# Altium project PowerTest.PrjPcb
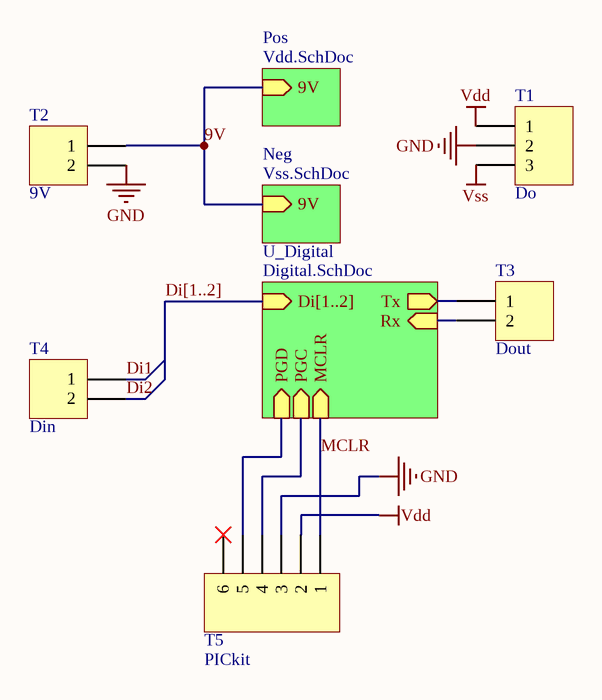
[diagram p0: Power.SchDoc]
4 sheets, 23 parts. Net scope: hierarchical (ports join the sheet entries above them; power ports are global).
Board file: PCB.PcbDoc
Sheets:
  Power.SchDoc
    U_Digital = Digital.SchDoc
    Pos = Vdd.SchDoc
    Neg = Vss.SchDoc

## Sheet Power.SchDoc
size A

### Parts
T1  Do  [HDR1X3]
T2  9V  [HDR1X2]
T3  Dout  [HDR1X2]
T4  Din  [HDR1X2]
T5  PICkit  [HDR1X6]

### Sub-sheets
Neg = Vss.SchDoc: 9V (in)
Pos = Vdd.SchDoc: 9V (in)
U_Digital = Digital.SchDoc: MCLR (in), Rx (in), Tx (out), PGD (in), PGC (in), Di[1..2] (in)

### Nets
GND: T1.2 T2.2 T5.3
Vdd: T1.1 T5.2
Vss: T1.3
9V: T2.1 ; sheet Pos/9V, sheet Neg/9V
Di1: T4.1
Di2: T4.2
MCLR: T5.1 ; sheet U_Digital/MCLR
NetT3_1: T3.1 ; sheet U_Digital/Tx
NetT3_2: T3.2 ; sheet U_Digital/Rx
NetT5_4: T5.4 ; sheet U_Digital/PGC
NetT5_5: T5.5 ; sheet U_Digital/PGD

Not connected (* = marked no-connect by the designer): T5 6*

### Buses and harness runs
bus Di[1..2] = sheet U_Digital/Di[1..2]

### Library data of the parts
T1 = Header 3: Header, 3-Pin; LatestRevisionDate: 17-Jul-2002; LatestRevisionNote: Re-released for DXP Platform.; Publisher: Altium Limited
T2-T4 = Header 2: Header, 2-Pin; LatestRevisionDate: 17-Jul-2002; LatestRevisionNote: Re-released for DXP Platform.; Publisher: Altium Limited
T5 = Header 6: Header, 6-Pin; LatestRevisionDate: 17-Jul-2002; LatestRevisionNote: Re-released for DXP Platform.; Publisher: Altium Limited

## Sheet Digital.SchDoc
size A
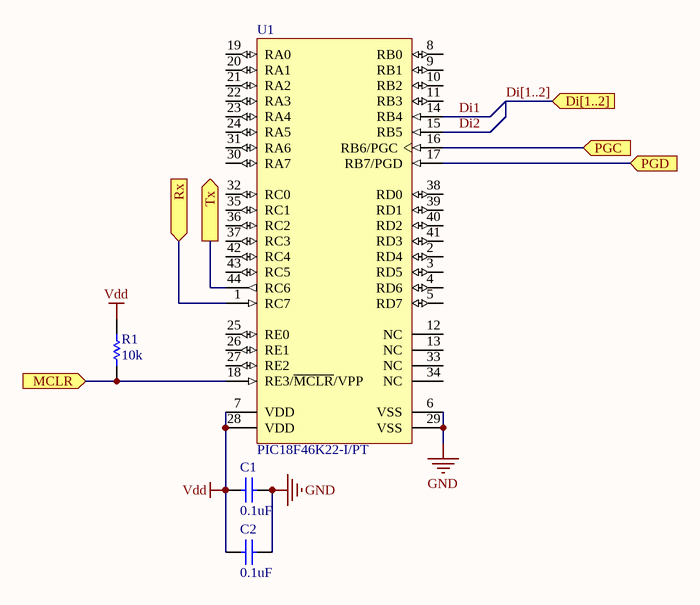
[diagram p1: Digital.SchDoc]

### Parts
C1  value 0.1uF  [1608[0603]]  (hidden comment: Cap)
C2  value 0.1uF  [1608[0603]]  (hidden comment: Cap)
R1  value 10k  [C1206]  (hidden comment: Res1)
U1  PIC18F46K22-I/PT  [MCHP-TQFP-PT44_N]

### Ports
Di[1..2] (in), MCLR (in), PGC (in), PGD (in), Rx (in), Tx (out)

### Nets
GND: C1.1 C2.1 U1.6(VSS) U1.29(VSS)
Vdd: C1.2 C2.2 R1.1 U1.7(VDD) U1.28(VDD)
Di1: U1.14(RB4)
Di2: U1.15(RB5)
MCLR: R1.2 U1.18(RE3/~{MCLR}/VPP) ; port MCLR
NetT3_1: U1.44(RC6) ; port Tx
NetT3_2: U1.1(RC7) ; port Rx
NetT5_4: U1.16(RB6/PGC) ; port PGC
NetT5_5: U1.17(RB7/PGD) ; port PGD

Not connected (* = marked no-connect by the designer): U1 2(RD4) 3(RD5) 4(RD6) 5(RD7) 8(RB0) 9(RB1) 10(RB2) 11(RB3) 12(NC) 13(NC) 19(RA0) 20(RA1) 21(RA2) 22(RA3) 23(RA4) 24(RA5) 25(RE0) 26(RE1) 27(RE2) 30(RA7) 31(RA6) 32(RC0) 33(NC) 34(NC) 35(RC1) 36(RC2) 37(RC3) 38(RD0) 39(RD1) 40(RD2) 41(RD3) 42(RC4) 43(RC5)

### Buses and harness runs
bus Di[1..2] = port Di[1..2]

### Library data of the parts
C1 C2 = Cap: Capacitor; Published: 8-Jun-2000; LatestRevisionDate: 17-Jul-2002; LatestRevisionNote: Re-released for DXP Platform.; PackageReference: RAD-0.3; Publisher: Altium Limited; PackageDescription: Radial Cap, Thru-Hole; 2 Leads; 0.3 in Pin Spacing
R1 = Res1: Resistor; Published: 8-Jun-2000; LatestRevisionDate: 17-Jul-2002; LatestRevisionNote: Re-released for DXP Platform.; PackageReference: AXIAL-0.3; Publisher: Altium Limited; PackageDescription: Axial Device, Thru-Hole; 2 Leads; 0.3 in Pin Spacing
U1 = PIC18F46K22-I/PT: Low-Power, High-Performance Microcontroller with XLP Technology, 64 MHz, 35 I/O, -40 to 85 degC, 44-pin TQFP (PT44), Tray; Manufacturer: Microchip; # of A/D Channels: 28; Digital Communication: 2 -A/E/USART, 2 -MSSP(SPI/I2C); EEPROM Data Memory (bytes): 1024; I/O Pins: 35; Internal Oscillator: 16 MHz, 31 kHz; Max. CPU Speed MHz: 64; Memory Type: Flash; Operation Voltage Range: 2.3V - 5.5V; Program Memory KWords: 32; RAM: 3896; Timers: 3 - 8-bit, 4 - 16-bit; DatasheetVersion: Rev. F; PackageVersion: C04-076B, 12/2012; PackageReference: TQFP-PT44; PackageDescription: 44-Lead Plastic Thin Quad Flatpack, 10 x 10 mm Body, 0.8 mm Pitch; Supplier 1: Digi-Key; Supplier Part Number 1: PIC18F46K22-I/PT-ND; Supplier 2: Farnell; Supplier Part Number 2: 1814980; Supplier 3: Farnell; Supplier Part Number 3: 1814980MPKG; Supplier 4: Newark; Supplier Part Number 4: 65R6013; Supplier 5: Mouser; Supplier Part Number 5: 579-PIC18F46K22IPT; Packing: TRAY; Program Memory KBytes: 64; RoHS: TRUE; Mounting Technology: Surface Mount; PartNumber: PIC18F46K22-I/PT; ComponentLink1Description: Datasheet; ComponentLink1URL: http://ww1.microchip.com/downloads/en/DeviceDoc/41412F.pdf; ComponentLink2Description: Package Specification; ComponentLink2URL: http://www.microchip.com/stellent/groups/techpub_sg/documents/packagingspec/en012702.pdf; ComponentLink3Description: URL Link1; ComponentLink3URL: Product URL:http://www.microchip.com/datasheet/PIC18F46K22

## Sheet Vdd.SchDoc
size A
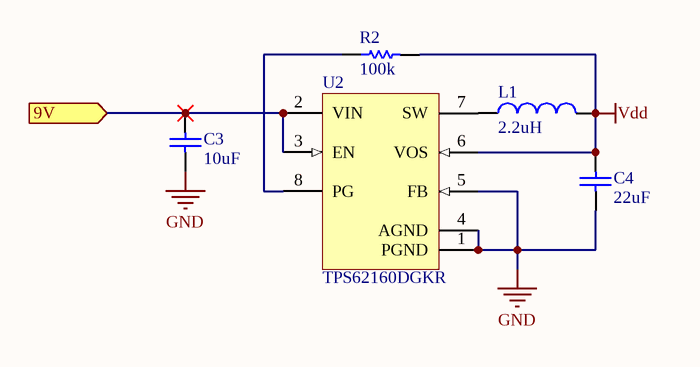
[diagram p2: Vdd.SchDoc]

### Parts
C3  value 10uF  [C1206]  (hidden comment: Cap)
C4  value 22uF  [C1206]  (hidden comment: Cap)
L1  value 2.2uH  [1608[0603]]  (hidden comment: Inductor)
R2  value 100k  [C1206]  (hidden comment: Res1)
U2  TPS62160DGKR  [DGK8_N]

### Ports
9V (in)

### Nets
GND: C3.1 C4.1 U2.1(PGND) U2.4(AGND) U2.5(FB)
Vdd: C4.2 L1.2 R2.2 U2.6(VOS)
9V: C3.2 U2.2(VIN) U2.3(EN) ; port 9V
NetL1_1: L1.1 U2.7(SW)
NetR2_1: R2.1 U2.8(PG)

### Library data of the parts
C3 C4 = Cap: Capacitor; Published: 8-Jun-2000; LatestRevisionDate: 17-Jul-2002; LatestRevisionNote: Re-released for DXP Platform.; PackageReference: RAD-0.3; Publisher: Altium Limited; PackageDescription: Radial Cap, Thru-Hole; 2 Leads; 0.3 in Pin Spacing
L1 = Inductor: Code_IEC: 1005; Published: 8-Jun-2000; LatestRevisionDate: 29-May-2009; LatestRevisionNote: IPC-7351 Footprint Added.; PackageReference: 0402-A; Publisher: Altium Limited; PackageDescription: Chip Inductor; Code_JEITA: 0402
R2 = Res1: Resistor; Published: 8-Jun-2000; LatestRevisionDate: 17-Jul-2002; LatestRevisionNote: Re-released for DXP Platform.; PackageReference: AXIAL-0.3; Publisher: Altium Limited; PackageDescription: Axial Device, Thru-Hole; 2 Leads; 0.3 in Pin Spacing
U2 = TPS62160DGKR: Buck Step Down Regulator with 3 to 17 V Input and 0.9 to 6 V Output, -40 to 85 degC, 8-Pin VSSOP (DGK), Green (RoHS & no Sb/Br); Manufacturer: Texas Instruments; Duty Cycle(Max)(%): 100; Iout(Max)(A): 1; Iq(Typ)(mA): 0.017; Rating: Catalog; SubFamily: Step-Down Regulator; Switch Current Limit(Typ)(A): 1.8; Synchronous Rectification: TRUE; Vin(Max)(V): 17; Vin(Min)(V): 3; Vout(Max)(V): 6; Vout(Min)(V): 0.9; DatasheetVersion: SLVSAM2A; PackageVersion: revE, May-2006; PackageReference: DGK8; PackageDescription: 8-Pin Thin Small Outline Package 3 x 3 mm Body ,0.65 mm Pitch; Supplier 1: Digi-Key; Supplier Part Number 1: TPS62160DGKR-ND; Supplier 2: Newark; Supplier Part Number 2: 92T2383; Supplier 3: Mouser; Supplier Part Number 3: 595-TPS62160DGKR; Eco-Plan: Green (RoHS & no Sb/Br); Regulated Outputs(#): 1; Topology: Buck; Mounting Technology: Surface Mount; Code_JEDEC: MO-187-AA; PartNumber: TPS62160DGKR; ComponentLink1Description: Datasheet; ComponentLink1URL: http://www.ti.com/general/docs/lit/getliterature.tsp?genericPartNumber=TPS62160&fileType=pdf; ComponentLink2Description: Package Specification; ComponentLink2URL: http://www.ti.com/lit/ml/mpds028d/mpds028d.pdf; ComponentLink3Description: URL Link1; ComponentLink3URL: Samples URL:http://www.ti.com/product/tps62160#samples

## Sheet Vss.SchDoc
size A
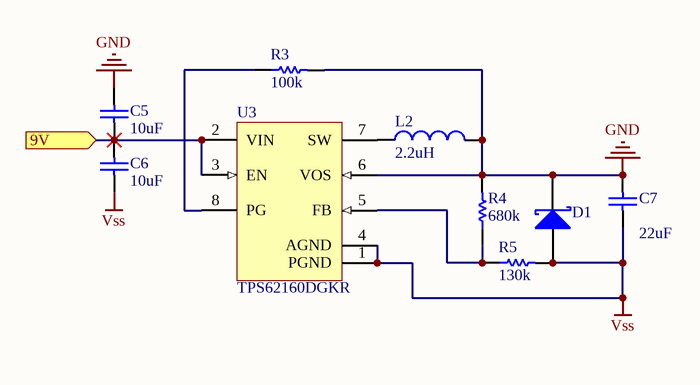
[diagram p3: Vss.SchDoc]

### Parts
C5  value 10uF  [C1206]  (hidden comment: Cap)
C6  value 10uF  [C1206]  (hidden comment: Cap)
C7  value 22uF  [C1206]  (hidden comment: Cap)
D1  D Schottky  [425]  (value not drawn)
L2  value 2.2uH  [1608[0603]]  (hidden comment: Inductor)
R3  value 100k  [C1206]  (hidden comment: Res1)
R4  value 680k  [C1206]  (hidden comment: Res1)
R5  value 130k  [C1206]  (hidden comment: Res1)
U3  TPS62160DGKR  [DGK8_N]

### Ports
9V (in)

### Nets
GND: C5.2 C7.2 D1.2(K) L2.2 R3.2 R4.2 U3.6(VOS)
Vss: C6.1 C7.1 D1.1(A) R5.2 U3.1(PGND) U3.4(AGND)
9V: C5.1 C6.2 U3.2(VIN) U3.3(EN) ; port 9V
NetL2_1: L2.1 U3.7(SW)
NetR3_1: R3.1 U3.8(PG)
NetR4_1: R4.1 R5.1 U3.5(FB)

### Library data of the parts
C5-C7 = Cap: Capacitor; Published: 8-Jun-2000; LatestRevisionDate: 17-Jul-2002; LatestRevisionNote: Re-released for DXP Platform.; PackageReference: RAD-0.3; Publisher: Altium Limited; PackageDescription: Radial Cap, Thru-Hole; 2 Leads; 0.3 in Pin Spacing
D1 = D Schottky: Schottky Diode; Published: 8-Jun-2000; LatestRevisionDate: 17-Jul-2002; LatestRevisionNote: Re-released for DXP Platform.; PackageReference: SMB; Publisher: Altium Limited; PackageDescription: DO-214-AA/SMB; 2 C-Bend Leads; Body 5.3 x 3.6 mm, inc. leads (LxW); Code_JEDEC: DO-214-AA
L2 = Inductor: Code_IEC: 1005; Published: 8-Jun-2000; LatestRevisionDate: 29-May-2009; LatestRevisionNote: IPC-7351 Footprint Added.; PackageReference: 0402-A; Publisher: Altium Limited; PackageDescription: Chip Inductor; Code_JEITA: 0402
R3-R5 = Res1: Resistor; Published: 8-Jun-2000; LatestRevisionDate: 17-Jul-2002; LatestRevisionNote: Re-released for DXP Platform.; PackageReference: AXIAL-0.3; Publisher: Altium Limited; PackageDescription: Axial Device, Thru-Hole; 2 Leads; 0.3 in Pin Spacing
U3 = TPS62160DGKR: as U2 on sheet Vdd; DatasheetVersion: SLVSAM2A; PackageVersion: revE, May-2006; PackageReference: DGK8; PackageDescription: 8-Pin Thin Small Outline Package 3 x 3 mm Body ,0.65 mm Pitch; Supplier 1: Digi-Key; Supplier Part Number 1: TPS62160DGKR-ND; Supplier 2: Newark; Supplier Part Number 2: 92T2383; Supplier 3: Mouser; Supplier Part Number 3: 595-TPS62160DGKR; Eco-Plan: Green (RoHS & no Sb/Br); Regulated Outputs(#): 1; Topology: Buck; Mounting Technology: Surface Mount; Code_JEDEC: MO-187-AA; PartNumber: TPS62160DGKR; ComponentLink1Description: Datasheet; ComponentLink1URL: http://www.ti.com/general/docs/lit/getliterature.tsp?genericPartNumber=TPS62160&fileType=pdf; ComponentLink2Description: Package Specification; ComponentLink2URL: http://www.ti.com/lit/ml/mpds028d/mpds028d.pdf; ComponentLink3Description: URL Link1; ComponentLink3URL: Samples URL:http://www.ti.com/product/tps62160#samples

## Nets that join several sheets
GND: Power (T1.2 T2.2 T5.3), Digital (C1.1 C2.1 U1.6 U1.29), Vdd (5 pins), Vss (7 pins)
Vdd: Power (T1.1 T5.2), Digital (5 pins), Vdd (C4.2 L1.2 R2.2 U2.6)
Vss: Power (T1.3), Vss (6 pins)
9V: Power (T2.1), Vdd (C3.2 U2.2 U2.3), Vss (C5.1 C6.2 U3.2 U3.3)
Di1: Power (T4.1), Digital (U1.14)
Di2: Power (T4.2), Digital (U1.15)
MCLR: Power (T5.1), Digital (R1.2 U1.18)
NetT3_1: Power (T3.1), Digital (U1.44)
NetT3_2: Power (T3.2), Digital (U1.1)
NetT5_4: Power (T5.4), Digital (U1.16)
NetT5_5: Power (T5.5), Digital (U1.17)